# EAGLE design POW-REV2 (EAGLE 7.4.0)
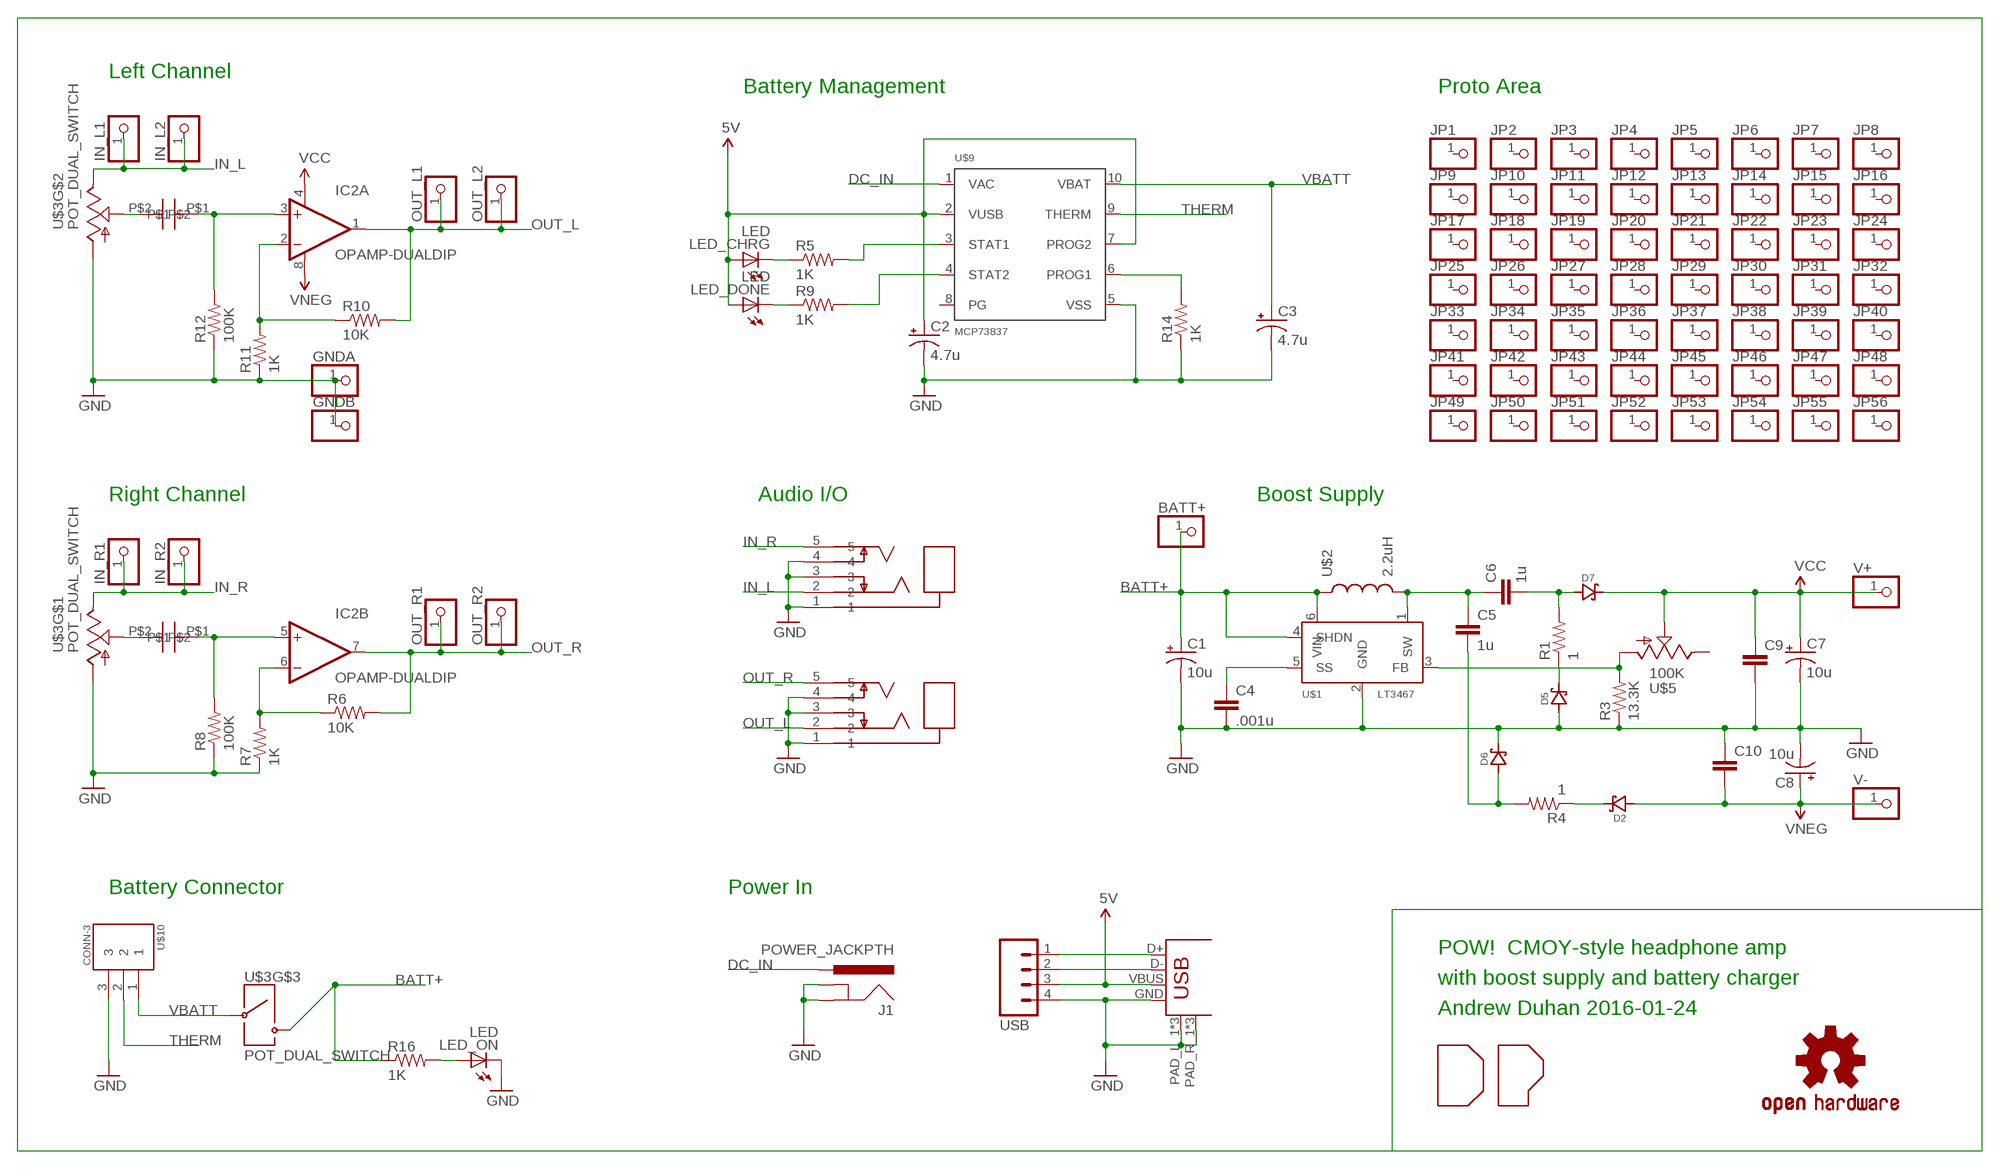
[diagram p0: schematic, sheet 1]

## Parts
BATT+  PINHD-1X1CB  [1X01-CLEANBIG]
C1  10u  CPOL-USE2,5-6E  [E2,5-6E]
C2  4.7u  CPOL-USE2,5-6E  [E2,5-6E]
C3  4.7u  CPOL-USE2,5-6E  [E2,5-6E]
C4  .001u  CAPPTH  [CAP-PTH-SMALL]
C5  1u  CAPPTH  [CAP-PTH-SMALL]
C6  1u  CAPPTH  [CAP-PTH-SMALL]
C7  10u  CPOL-USE2,5-6E  [E2,5-6E]
C8  10u  CPOL-USE2,5-6E  [E2,5-6E]
C9  CAPPTH  [CAP-PTH-SMALL]
C10  CAPPTH  [CAP-PTH-SMALL]
D2  SCHOTTKY  [SOD-123]
D5  SCHOTTKY  [SOD-123]
D6  SCHOTTKY  [SOD-123]
D7  SCHOTTKY  [SOD-123]
GNDA  PINHD-1X1CB  [1X01-CLEANBIG]
GNDB  PINHD-1X1CB  [1X01-CLEANBIG]
IC2  OPAMP-DUALDIP  [DIP08]
IN_JACK  JACK_STEREO_SWCUI-SJ1-351X  [AUDIO_JACK-CUI-SJ1-351X]
IN_L1  PINHD-1X1CB  [1X01-CLEANBIG]
IN_L2  PINHD-1X1CB  [1X01-CLEANBIG]
IN_R1  PINHD-1X1CB  [1X01-CLEANBIG]
IN_R2  PINHD-1X1CB  [1X01-CLEANBIG]
J1  POWER_JACKPTH  [POWER_JACK_PTH]
JP1  PINHD-1X1CB  [1X01-CLEANBIG]
JP2  PINHD-1X1CB  [1X01-CLEANBIG]
JP3  PINHD-1X1CB  [1X01-CLEANBIG]
JP4  PINHD-1X1CB  [1X01-CLEANBIG]
JP5  PINHD-1X1CB  [1X01-CLEANBIG]
JP6  PINHD-1X1CB  [1X01-CLEANBIG]
JP7  PINHD-1X1CB  [1X01-CLEANBIG]
JP8  PINHD-1X1CB  [1X01-CLEANBIG]
JP9  PINHD-1X1CB  [1X01-CLEANBIG]
JP10  PINHD-1X1CB  [1X01-CLEANBIG]
JP11  PINHD-1X1CB  [1X01-CLEANBIG]
JP12  PINHD-1X1CB  [1X01-CLEANBIG]
JP13  PINHD-1X1CB  [1X01-CLEANBIG]
JP14  PINHD-1X1CB  [1X01-CLEANBIG]
JP15  PINHD-1X1CB  [1X01-CLEANBIG]
JP16  PINHD-1X1CB  [1X01-CLEANBIG]
JP17  PINHD-1X1CB  [1X01-CLEANBIG]
JP18  PINHD-1X1CB  [1X01-CLEANBIG]
JP19  PINHD-1X1CB  [1X01-CLEANBIG]
JP20  PINHD-1X1CB  [1X01-CLEANBIG]
JP21  PINHD-1X1CB  [1X01-CLEANBIG]
JP22  PINHD-1X1CB  [1X01-CLEANBIG]
JP23  PINHD-1X1CB  [1X01-CLEANBIG]
JP24  PINHD-1X1CB  [1X01-CLEANBIG]
JP25  PINHD-1X1CB  [1X01-CLEANBIG]
JP26  PINHD-1X1CB  [1X01-CLEANBIG]
JP27  PINHD-1X1CB  [1X01-CLEANBIG]
JP28  PINHD-1X1CB  [1X01-CLEANBIG]
JP29  PINHD-1X1CB  [1X01-CLEANBIG]
JP30  PINHD-1X1CB  [1X01-CLEANBIG]
JP31  PINHD-1X1CB  [1X01-CLEANBIG]
JP32  PINHD-1X1CB  [1X01-CLEANBIG]
JP33  PINHD-1X1CB  [1X01-CLEANBIG]
JP34  PINHD-1X1CB  [1X01-CLEANBIG]
JP35  PINHD-1X1CB  [1X01-CLEANBIG]
JP36  PINHD-1X1CB  [1X01-CLEANBIG]
JP37  PINHD-1X1CB  [1X01-CLEANBIG]
JP38  PINHD-1X1CB  [1X01-CLEANBIG]
JP39  PINHD-1X1CB  [1X01-CLEANBIG]
JP40  PINHD-1X1CB  [1X01-CLEANBIG]
JP41  PINHD-1X1CB  [1X01-CLEANBIG]
JP42  PINHD-1X1CB  [1X01-CLEANBIG]
JP43  PINHD-1X1CB  [1X01-CLEANBIG]
JP44  PINHD-1X1CB  [1X01-CLEANBIG]
JP45  PINHD-1X1CB  [1X01-CLEANBIG]
JP46  PINHD-1X1CB  [1X01-CLEANBIG]
JP47  PINHD-1X1CB  [1X01-CLEANBIG]
JP48  PINHD-1X1CB  [1X01-CLEANBIG]
JP49  PINHD-1X1CB  [1X01-CLEANBIG]
JP50  PINHD-1X1CB  [1X01-CLEANBIG]
JP51  PINHD-1X1CB  [1X01-CLEANBIG]
JP52  PINHD-1X1CB  [1X01-CLEANBIG]
JP53  PINHD-1X1CB  [1X01-CLEANBIG]
JP54  PINHD-1X1CB  [1X01-CLEANBIG]
JP55  PINHD-1X1CB  [1X01-CLEANBIG]
JP56  PINHD-1X1CB  [1X01-CLEANBIG]
LED_CHRG  LED  [SSF-LXH25780ID]
LED_DONE  LED  [SSF-LXH25780ID]
LED_ON  LED  [SSF-LXH25780ID]
LOGO1  OSHW-LOGOS  [OSHW-LOGO-S]
OUT_JACK  JACK_STEREO_SWCUI-SJ1-351X  [AUDIO_JACK-CUI-SJ1-351X]
OUT_L1  PINHD-1X1CB  [1X01-CLEANBIG]
OUT_L2  PINHD-1X1CB  [1X01-CLEANBIG]
OUT_R1  PINHD-1X1CB  [1X01-CLEANBIG]
OUT_R2  PINHD-1X1CB  [1X01-CLEANBIG]
R1  1  RESISTORAXIAL-0.3  [AXIAL-0.3]
R3  13.3K  RESISTORAXIAL-0.3  [AXIAL-0.3]
R4  1  RESISTORAXIAL-0.3  [AXIAL-0.3]
R5  1K  RESISTORAXIAL-0.3  [AXIAL-0.3]
R6  10K  RESISTORAXIAL-0.3  [AXIAL-0.3]
R7  1K  RESISTORAXIAL-0.3  [AXIAL-0.3]
R8  100K  RESISTORAXIAL-0.3  [AXIAL-0.3]
R9  1K  RESISTORAXIAL-0.3  [AXIAL-0.3]
R10  10K  RESISTORAXIAL-0.3  [AXIAL-0.3]
R11  1K  RESISTORAXIAL-0.3  [AXIAL-0.3]
R12  100K  RESISTORAXIAL-0.3  [AXIAL-0.3]
R14  1K  RESISTORAXIAL-0.3  [AXIAL-0.3]
R16  1K  RESISTORAXIAL-0.3  [AXIAL-0.3]
U$1  LT3467  [SOT23-6]
U$2  2.2uH  INDUCTOR-SMD-MED6  [INDUCTOR_4.5X5]
U$3  POT_DUAL_SWITCH  [POT_ALPS_RK097]
U$4  USB  [USB-MICRO-MOLEX-SMD]
U$5  100K  TRIMPOTMURATA  [TRIM-MURATA-PV36W]
U$6  DP_LOGO  [DP_LOGO]
U$7  0.1u  CAPMKP_RADIAL_7.2X6  [CAP-MKP_RADIAL]
U$8  0.1u  CAPMKP_RADIAL_7.2X6  [CAP-MKP_RADIAL]
U$9  MCP73837  [MSOP-10]
U$10  CONN-3  [CONN-0530480310]
USB  M04PTH  [1X04]
V+  PINHD-1X1CB  [1X01-CLEANBIG]
V-  PINHD-1X1CB  [1X01-CLEANBIG]

## Nets
5V: C2.+ LED_CHRG.ANODE(A) LED_DONE.ANODE(A) U$4.VBUS U$9.2(VUSB) U$9.7(PROG2) USB.3
BATT+: BATT+.1 C1.+ R16.P$1 U$1.4(SHDN) U$1.6(VIN) U$2.P$1 U$3.SW1
DC_IN: J1.PWR U$9.1(VAC)
GND: C1.- C2.- C3.- C4.2 C7.- C8.- C9.2 C10.1 D5.ANODE D6.CATHODE GNDA.1 GNDB.1 IN_JACK.1 IN_JACK.3 IN_JACK.4 J1.GND J1.GNDBREAK LED_ON.CATHODE(C) OUT_JACK.1 OUT_JACK.3 OUT_JACK.4 R3.P$1 R7.P$1 R8.P$1 R11.P$1 R12.P$1 R14.P$1 U$1.2(GND) U$3.POT1_A(A) U$3.POT2_A(A) U$4.GND U$4.PAD_L_1 U$4.PAD_L_2 U$4.PAD_L_3 U$4.PAD_R_1 U$4.PAD_R_2 U$4.PAD_R_3 U$9.5(VSS) U$10.3 USB.4
IN_L: IN_JACK.2 IN_L1.1 IN_L2.1 U$3.POT2_B(B)
IN_R: IN_JACK.5 IN_R1.1 IN_R2.1 U$3.POT1_B(B)
N$1: LED_ON.ANODE(A) R16.P$2
N$2: LED_CHRG.CATHODE(C) R5.P$1
N$3: C4.1 U$1.5(SS)
N$4: C5.1 C6.1 U$1.1(SW) U$2.P$2
N$5: C5.2 D6.ANODE R4.P$2
N$6: R3.P$2 U$1.3(FB) U$5.A
N$7: C6.2 D7.ANODE R1.P$2
N$8: IC2.6(B:-IN) R6.P$1 R7.P$2
N$9: D2.CATHODE R4.P$1
N$10: IC2.5(B:+IN) R8.P$2 U$7.P$1
N$11: D5.CATHODE R1.P$1
N$12: IC2.3(A:+IN) R12.P$2 U$8.P$1
N$13: IC2.2(A:-IN) R10.P$1 R11.P$2
N$14: LED_DONE.CATHODE(C) R9.P$1
N$15: U$3.POT1_W(W) U$7.P$2
N$16: U$3.POT2_W(W) U$8.P$2
N$18: R5.P$2 U$9.3(STAT1)
N$19: R9.P$2 U$9.4(STAT2)
N$23: R14.P$2 U$9.6(PROG1)
OUT_L: IC2.1(A:OUT) OUT_JACK.2 OUT_L1.1 OUT_L2.1 R10.P$2
OUT_R: IC2.7(B:OUT) OUT_JACK.5 OUT_R1.1 OUT_R2.1 R6.P$2
THERM: U$9.9(THERM) U$10.2
USB_D+: U$4.D+ USB.1
USB_D-: U$4.D- USB.2
VBATT: C3.+ U$3.SW2 U$9.10(VBAT) U$10.1
VCC: C7.+ C9.1 D7.CATHODE IC2.4(A:V-) U$5.W V+.1
VNEG: C8.+ C10.2 D2.ANODE IC2.8(A:V+) V-.1
Unconnected: JP1.1 JP2.1 JP3.1 JP4.1 JP5.1 JP6.1 JP7.1 JP8.1 JP9.1 JP10.1 JP11.1 JP12.1 JP13.1 JP14.1 JP15.1 JP16.1 JP17.1 JP18.1 JP19.1 JP20.1 JP21.1 JP22.1 JP23.1 JP24.1 JP25.1 JP26.1 JP27.1 JP28.1 JP29.1 JP30.1 JP31.1 JP32.1 JP33.1 JP34.1 JP35.1 JP36.1 JP37.1 JP38.1 JP39.1 JP40.1 JP41.1 JP42.1 JP43.1 JP44.1 JP45.1 JP46.1 JP47.1 JP48.1 JP49.1 JP50.1 JP51.1 JP52.1 JP53.1 JP54.1 JP55.1 JP56.1 U$5.B U$9.8(PG)

## Notes on the sheet
- Left Channel
- Battery Management | Proto Area
- Right Channel | Audio I/O | Boost Supply
- Battery Connector | Power In
- POW!  CMOY-style headphone amp
- with boost supply and battery charger
- Andrew Duhan 2016-01-24

## Library data of the parts
BATT+ GNDA GNDB IN_L1 IN_L2 IN_R1 IN_R2 JP1-JP56 OUT_L1 OUT_L2 OUT_R1 OUT_R2 V+ V- = adafruit:PINHD-1X1: Pin header 1x1 for 0.1" spacing With round pins
C1-C3 C7 C8 = adafruit:CPOL-US: POLARIZED CAPACITOR, American symbol
C4-C6 C9 C10 = SparkFun-Capacitors:CAP: Capacitor Standard 0603 ceramic capacitor, and 0.1" leaded capacitor.
D2 D5-D7 = myparts:SCHOTTKY
IC2 = SparkFun-AnalogIC:OPAMP-DUAL: Generic op-amp footprint
IN_JACK OUT_JACK = myparts:JACK_STEREO_SW
J1 = SparkFun-Connectors:POWER_JACK: Power Jack This is the standard 5.5mm barrel jack for power. The PTH is the most common, proven, reliable, footprint. The Slot footprint only works if the mill layer is transmitted to the PCB fab house so be warned. Spark Fun Electronics SKU : PRT-00119 SMT: CONN-08106 Mating wall wart : TOL-00298 (and others)
LED_CHRG LED_DONE LED_ON = myparts:LED
LOGO1 = SparkFun-Aesthetics:OSHW-LOGO: Open Source Hardware Logo This logo indicates the piece of hardware it is found on incorporates a OSHW license and/or adheres to the definition of open source hardware found here: http://freedomdefined.org/OSHW
R1 R3-R12 R14 R16 = SparkFun-Resistors:RESISTOR: Resistor Basic schematic elements and footprints for 0603, 1206, and PTH resistors.
U$1 = myparts:LT3467
U$2 = myparts:INDUCTOR-SMD-MED
U$3 = myparts:POT_DUAL_SWITCH
U$4 = myparts:USB
U$5 = myparts:TRIMPOT
U$6 = myparts:DP_LOGO: Duhan Power! logo
U$7 U$8 = myparts:CAP
U$9 = myparts:MCP73837
U$10 = myparts:CONN-3
USB = SparkFun-Connectors:M04: Header 4 Standard 4-pin 0.1" header. Use with straight break away headers (SKU : PRT-00116), right angle break away headers (PRT-00553), swiss pins (PRT-00743), machine pins (PRT-00117), and female headers (PRT-00115). Molex polarized connector foot print use with SKU : PRT-08231 with associated crimp pins and housings. 1MM SMD Version SKU: PRT-10208

## Board
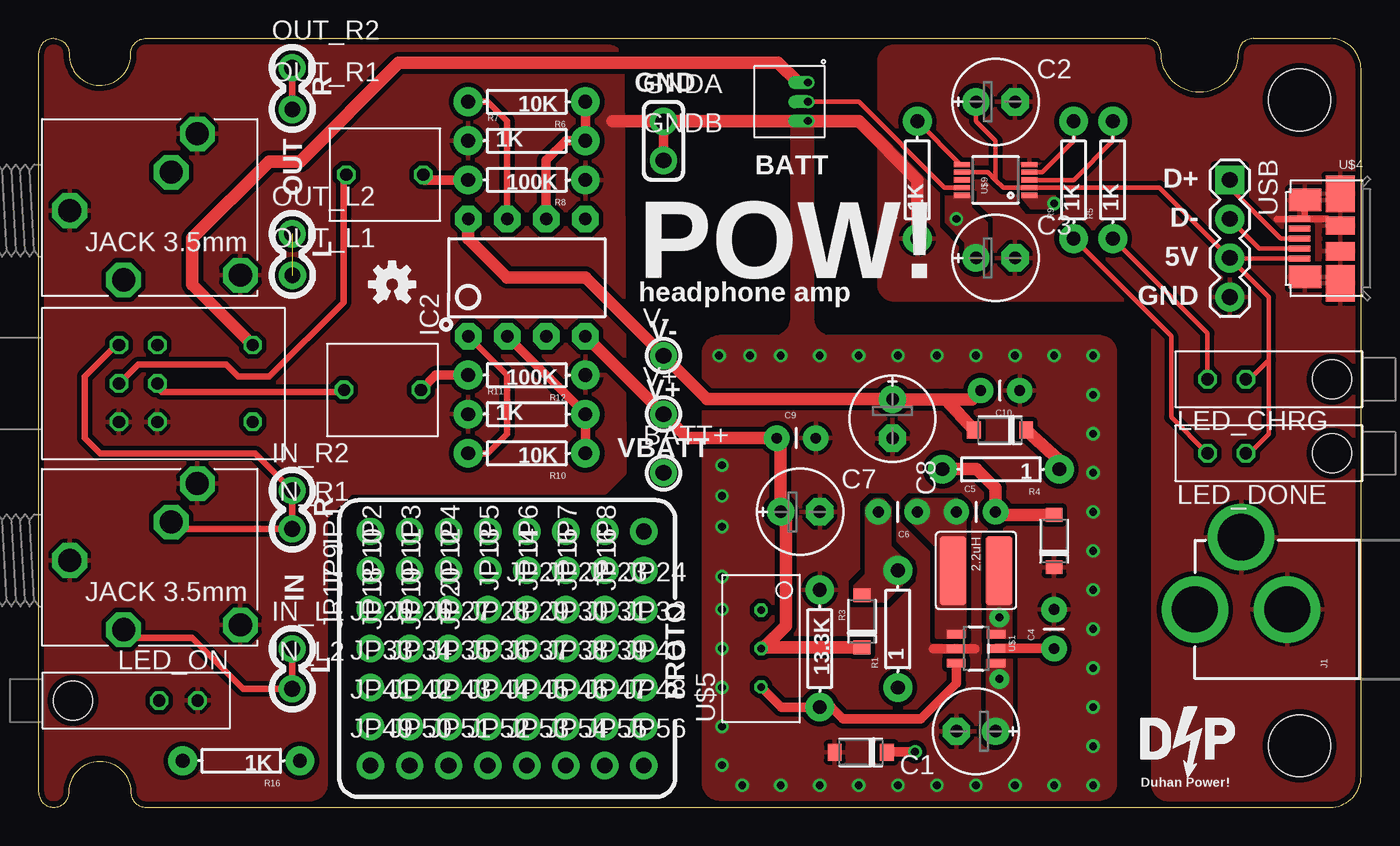
[diagram p1: board, top side]
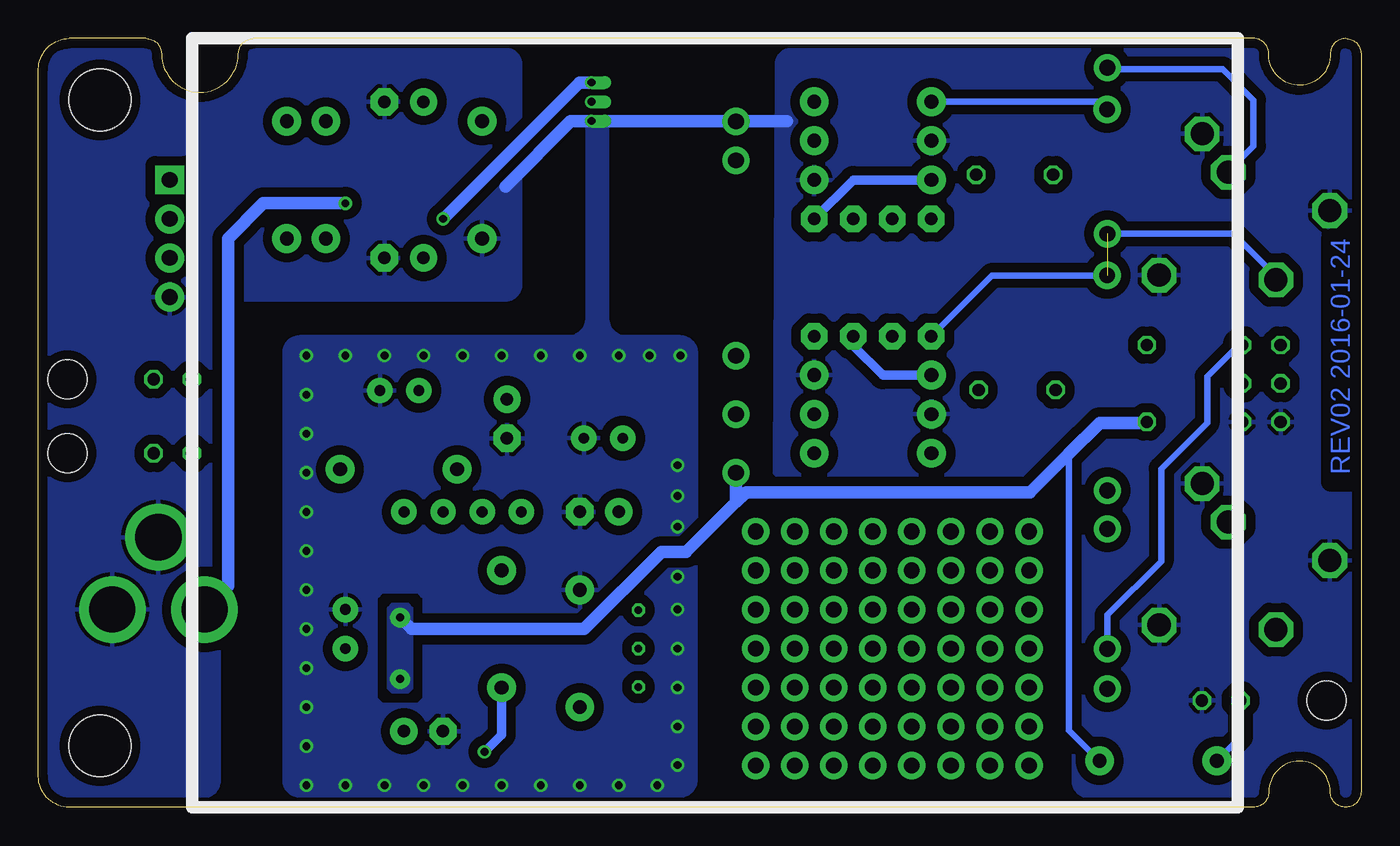
[diagram p2: board, bottom side, seen from below]

Size 86 x 50 mm. Coordinates in mm from the lower left corner, seen from the top.
Outline: 84,0 arc90 86,2 86,48 arc90 84,50 79,50 arc90 78,49 arc-180 73,49 arc90 72,50 6.9,50 arc90 6,48.9 arc-180 2,49 arc90 1,50 arc90 0,49 0,1 arc90 1,0 arc90 2,1 arc-180 6,1 arc90 7,0 84,0
Copper layers (1*16): Top 0.0356mm / dielectric 1.5011mm / Bottom 0.0356mm
Design rules "LaenPCBOrder *": minimum track width 6mil, minimum drill 13mil, track to track 6mil, track to pad 6mil, pad to pad 6mil, via to via 6mil, smd to smd 6mil, copper to edge 15mil, drill to drill 6mil, minimum pad ring 7mil, minimum via ring 7mil, stop-mask expansion 4mil, vias tented up to drill 24mil, thermal gap 10mil
Holes 4 mm at 82,4 82,46

### Footprints (pad centres in the part's own frame; a part is rotated, then mirrored left to right if it is on the bottom)
1X01-CLEANBIG = drill 1.016 pad 1.778: 1 0,0
E2,5-6E = drill 0.813 pad 1.778: + -1.27,0 | drill 0.813 pad 1.778 octagon: - 1.27,0
CAP-PTH-SMALL = drill 0.7 pad 1.651: 1 0,0; 2 2.54,0
SOD-123 = smd 0.9 x 1.1: ANODE -1.7,0; CATHODE 1.7,0
DIP08 = drill 0.813 pad 1.727 octagon: 1 -3.81,-3.81; 2 -1.27,-3.81; 3 1.27,-3.81; 4 3.81,-3.81; 5 3.81,3.81; 6 1.27,3.81; 7 -1.27,3.81; 8 -3.81,3.81
AUDIO_JACK-CUI-SJ1-351X = drill 1.5 octagon: 1 0,0; 2 3.5,-4.5; 3 8.3,5; 4 11.1,-4.2; 5 6.6,2.5
POWER_JACK_PTH = drill 2.997 pad 4.318: GND 0,7.7; GNDBREAK 4.7,10.7; PWR 0,13.7
SSF-LXH25780ID = drill 0.8 octagon: ANODE -1.5,0; CATHODE -4,0 | hole 2.54: 4.1,0
AXIAL-0.3 = drill 0.9 pad 1.88: P$1 -3.81,0; P$2 3.81,0
SOT23-6 = smd 0.55 x 1.2: 1 -0.95,-1.3; 2 0,-1.3; 3 0.95,-1.3; 4 0.95,1.3; 5 0,1.3; 6 -0.95,1.3
INDUCTOR_4.5X5 = smd 4.5 x 1.75: P$1 0,1.5; P$2 0,-1.5
POT_ALPS_RK097 = drill 0.8 octagon: POT1_A 2.9,2.5; POT1_B 2.9,-2.5; POT1_W 2.9,0; POT2_A 0.4,2.5; POT2_B 0.4,-2.5; POT2_W 0.4,0; SW1 -5.8,2.5; SW2 -5.8,-2.5
USB-MICRO-MOLEX-SMD = smd 0.4 x 1.38: D+ 0,4.11; D- -0.65,4.11; GND 1.3,4.11; ID 0.65,4.11; VBUS -1.3,4.11 | smd 1.475 x 2.1: PAD_L_1 -2.5,3.75; PAD_R_1 2.5,3.75 | smd 2.375 x 1.9: PAD_L_2 -2.913,1.45; PAD_R_2 2.913,1.45 | smd 1.175 x 1.9: PAD_L_3 -0.838,1.45; PAD_R_3 0.838,1.45
TRIM-MURATA-PV36W = drill 0.5 octagon: A -2.5,0; B 2.5,0; W 0,0
CAP-MKP_RADIAL = drill 0.8 octagon: P$1 -2.5,0; P$2 2.5,0
MSOP-10 = smd 0.34 x 1.04: 1 -1,-2.2; 2 -0.5,-2.2; 3 0,-2.2; 4 0.5,-2.2; 5 1,-2.2; 6 1,2.2; 7 0.5,2.2; 8 0,2.2; 9 -0.5,2.2; 10 -1,2.2
CONN-0530480310 = drill 0.5 pad 0.813 offset: 1 1.25,0; 2 0,0; 3 -1.25,0
1X04 = drill 1.016 pad 1.88 square: 1 0,0 | drill 1.016 pad 1.88: 2 2.54,0; 3 5.08,0; 4 7.62,0

### Placement (x,y rotation side)
BATT+  40.64,21.75 0 top
C1  60.96,4.94 180 top
C2  62.23,45.88 0 top
C3  62.23,35.72 0 top
C4  66.04,10.32 90 top
C5  59.69,19.21 0 top
C6  57.15,19.21 180 top
C7  49.53,19.21 0 top
C8  55.53,25.26 270 top
C9  48,24 0 top
C10  63.8,27.1 180 top
D2  62.52,24.53 0 top
D5  53.47,3.57 0 top
D6  66.04,17.31 270 top
D7  53.54,12.09 270 top
GNDA  40.64,44.61 0 top
GNDB  40.64,42.07 0 top
IC2  31.75,34.45 0 top
IN_JACK  2.03,16.05 0 top
IN_L1  16.5,10.3 0 top
IN_L2  16.5,7.7 0 top
IN_R1  16.5,18.1 0 top
IN_R2  16.5,20.6 0 top
J1  88.9,12.86 90 top
JP1  21.59,17.94 90 top
JP2  24.13,17.94 90 top
JP3  26.67,17.94 90 top
JP4  29.21,17.94 90 top
JP5  31.75,17.94 90 top
JP6  34.29,17.94 90 top
JP7  36.83,17.94 90 top
JP8  39.37,17.94 90 top
JP9  21.59,15.4 90 top
JP10  24.13,15.4 90 top
JP11  26.67,15.4 90 top
JP12  29.21,15.4 90 top
JP13  31.75,15.4 90 top
JP14  34.29,15.4 90 top
JP15  36.83,15.4 90 top
JP16  39.37,15.4 90 top
JP17  21.59,12.86 90 top
JP18  24.13,12.86 90 top
JP19  26.67,12.86 90 top
JP20  29.21,12.86 90 top
JP21  31.75,12.86 0 top
JP22  34.29,12.86 0 top
JP23  36.83,12.86 0 top
JP24  39.37,12.86 0 top
JP25  21.59,10.32 0 top
JP26  24.13,10.32 0 top
JP27  26.67,10.32 0 top
JP28  29.21,10.32 0 top
JP29  31.75,10.32 0 top
JP30  34.29,10.32 0 top
JP31  36.83,10.32 0 top
JP32  39.37,10.32 0 top
JP33  21.59,7.78 0 top
JP34  24.13,7.78 0 top
JP35  26.67,7.78 0 top
JP36  29.21,7.78 0 top
JP37  31.75,7.78 0 top
JP38  34.29,7.78 0 top
JP39  36.83,7.78 0 top
JP40  39.37,7.78 0 top
JP41  21.59,5.24 0 top
JP42  24.13,5.24 0 top
JP43  26.67,5.24 0 top
JP44  29.21,5.24 0 top
JP45  31.75,5.24 0 top
JP46  34.29,5.24 0 top
JP47  36.83,5.24 0 top
JP48  39.37,5.24 0 top
JP49  21.59,2.7 0 top
JP50  24.13,2.7 0 top
JP51  26.67,2.7 0 top
JP52  29.21,2.7 0 top
JP53  31.75,2.7 0 top
JP54  34.29,2.7 0 top
JP55  36.83,2.7 0 top
JP56  39.37,2.7 0 top
LED_CHRG  80.01,27.83 0 top
LED_DONE  80.01,23.02 0 top
LED_ON  6.35,6.94 180 top
LOGO1  23,34 0 top
OUT_JACK  2.03,38.8 0 top
OUT_L1  16.51,34.59 0 top
OUT_L2  16.5,37.3 0 top
OUT_R1  16.51,45.38 0 top
OUT_R2  16.5,48.1 0 top
R1  55.88,11.59 90 top
R3  50.8,10.32 270 top
R4  62.58,21.98 180 top
R5  69.85,40.8 90 top
R6  31.75,45.88 180 top
R7  31.75,43.34 0 top
R8  31.75,40.8 180 top
R9  67.31,40.8 90 top
R10  31.75,23.02 180 top
R11  31.75,25.56 0 top
R12  31.75,28.1 180 top
R14  57.15,40.8 90 top
R16  13.19,3.02 180 top
U$1  60.96,10.32 270 top
U$2  60.96,15.4 270 top
U$3  8.13,27.56 180 top
U$4  86.11,36.99 90 top
U$5  46.99,10.32 90 top
U$6  74.56,4.46 0 top
U$7  22.53,41.14 180 top
U$8  22.37,27.14 180 top
U$9  62.23,40.8 90 top
U$10  50.04,45.88 90 top
USB  77.47,40.8 270 top
V+  40.64,25.56 0 top
V-  40.64,29.37 0 top

### Tracks (layer width: path | path; a pad name or v marks a point on that pad's centre or on a via)
5V
  Top 0.305: U$9.7 61.73,41.3 62.23,40.8 | 62.23,40.8 62.73,40.3 U$9.2 72.89,40.3 USB.3 | C2.+ 60.96,44.61 62.23,43.34 62.23,40.8 | U$4.VBUS 77.5,35.69 USB.3 | LED_CHRG.ANODE 78.74,27.83 80.01,29.1 | 80.01,29.1 80.01,33.18 USB.3 | LED_DONE.ANODE 78.74,23.02 80.01,24.29 80.01,29.1
BATT+  (via drill 0.51 pad 1.27)
  Top 0.61: 62.26,5.27 C1.+
  Bottom 0.406: 19,23 19,5 17,3 R16.P$1
  Bottom 0.813: v62.48,12.34 61.73,11.59 50.51,11.59 45.5,16.6 43.88,16.6 40.64,19.84 | 40.64,19.84 40,20.48 21.52,20.48 19,23 17,25 13.99,25 U$3.SW1 | BATT+.1 40.64,19.84
  other vias: 62.48,8.34
  pour Top (isolate 0.254, no thermals): 61.72,17.43 61.72,11.08 63.25,11.08 63.25,17.43
  pour Top (isolate 0.254, no thermals): 61.72,9.56 63.25,9.56 63.25,5.24 62.74,4.73 61.72,4.73
  pour Bottom (isolate 0.61, no thermals): 61.72,7.78 61.72,12.91 61.98,13.16 62.99,13.16 63.25,12.91 63.25,7.78 62.99,7.53 61.98,7.53
DC_IN  (via drill 0.51)
  Bottom 0.813: v66.04,39.28 71.37,39.28 73.66,36.99 73.66,14.4 J1.PWR
  pour Top (no thermals): 63.9,39.8 66.1,39.8 66.4,39.5 66.4,39.1 66.2,38.9 64.5,38.9 63.9,39.6
GND  (via drill 0.51)
  Top 0.305: 47.01,44.63 46.99,44.61
  Top 0.406: U$4.GND 83.79,38.29 83.82,38.26 82.3,38.26 | 82.3,38.26 80.52,38.26 | U$4.PAD_R_1 82.36,38.32 82.3,38.26
  Top 0.61: 60.9,10.3 58.2,10.3 | GNDB.1 GNDA.1
  Top 0.813: 37.34,44.61 GNDA.1 46.99,44.61 53.34,44.61 57.15,40.8 R14.P$1
  Bottom 0.813: 50.06,44.61 37.34,44.61 | 55.63,40.37 51.39,44.61 50.06,44.61 | 50.06,44.61 U$10.3
  other vias: 48.26,1.43 50.8,1.43 53.34,1.43 55.88,1.43 58.42,1.43 60.96,1.43 63.5,1.43 66.04,1.43 68.58,1.43 68.58,3.97 68.58,6.51 68.58,9.05 68.58,11.59 68.58,14.13 68.58,16.67 68.58,19.21 68.58,21.75 68.58,24.29 68.58,26.83 68.58,29.37 66.04,29.37 48.26,29.37 50.8,29.37 53.34,29.37 63.5,29.37 60.96,29.37 58.42,29.37 55.88,29.37 44.45,18.24 44.45,15 44.45,12.86 44.45,10.32 44.45,7.78 44.45,5.24 44.45,20.24 44.45,22.24 46.26,29.37 44.26,29.37 44.45,2.74 45.76,1.43
  pour Top (isolate 0.305): -0.02,49.49 36.98,49.48 arc-90 37.98,48.48 38.1,21.75 36.83,20.48 20.32,20.48 18.68,18.84 18.68,1.52 arc-88 17.68,0.52 -0.02,0.52
  pour Bottom (isolate 0.61, rank 6): -0.02,49.28 36.98,49.28 arc-90 37.98,48.28 38.1,21.75 36.83,20.48 20.32,20.48 18.68,18.84 18.68,1.72 arc-90 17.68,0.72 -0.02,0.72
  pour Top (isolate 0.305, rank 6): 43.29,1.56 43.29,29.56 arc-90 44.29,30.56 69,30.56 arc-90 70,29.56 70,1.56 arc-90 69,0.56 44.29,0.56 arc-90
  pour Bottom (isolate 0.61, rank 6): 43.29,1.76 43.25,29.52 arc-90 44.29,30.56 69,30.56 arc-90 70,29.56 70,1.76 arc-90 69,0.76 44.29,0.76 arc-90
  pour Top (isolate 0.305, rank 6): 55.67,49.48 84.76,49.48 arc-90 86.02,48.22 86.02,1.52 arc-90 85.02,0.52 73.49,0.52 arc-90 72.49,1.52 72.49,31.02 arc90 70.49,33.02 55.67,33.02 arc-90 54.67,34.02 54.67,48.48 arc-90
  pour Bottom (isolate 0.61, rank 6): 55.67,33.02 72.29,33.02 arc-90 74.29,31.02 74.29,1.72 arc90 75.29,0.72 85.02,0.72 arc90 86.02,1.72 86.02,48.04 arc90 84.78,49.28 55.67,49.28 arc90 54.67,48.28 54.67,34.02 arc90
  pour Top (isolate 0.254, no thermals): 49.02,44.86 50.29,44.86 50.29,31.81 arc90 51.56,30.54 52.07,30.54 52.07,29.37 46.99,29.37 46.99,30.54 47.75,30.54 arc90 49.02,31.81
  pour Bottom (isolate 0.254, no thermals): 49.02,44.86 50.29,44.86 50.29,31.81 arc90 51.56,30.54 52.07,30.54 52.07,29.37 46.99,29.37 46.99,30.54 47.75,30.54 arc90 49.02,31.81
IN_L
  Top 0.406: IN_JACK.2 6.08,11 10,11 13.3,7.7 IN_L2.1 IN_L1.1
  Bottom 0.406: U$3.POT2_B 7.94,30.06 10,28 10,25 13,22 13,16 16.5,12.5 IN_L1.1
IN_R
  Top 0.406: IN_JACK.5 9.08,18.1 IN_R1.1 IN_R2.1 14.1,23 4,23 3,24 3,28 5.06,30.06 U$3.POT1_B
N$1
  Bottom 0.406: LED_ON.ANODE 7.85,4.55 R16.P$2
N$2
  Top 0.305: LED_CHRG.CATHODE 76.01,30.83 R5.P$1
N$3
  Top 0.61: U$1.5 C4.1
N$4
  pour Top (isolate 0.254, no thermals): 58.42,16.99 58.42,11.08 60.2,11.08 60.2,19.46 59.69,19.97 56.9,19.97 56.48,19.56 56.48,18.96
N$5
  Top 0.813: D6.ANODE 62.43,19.01 C5.2 62.23,20.77 61,22 58.79,22 R4.P$2
N$6
  Top 0.61: U$1.3 59.69,9.34 59.69,8.05 57.39,5.75 52.32,5.75 51.56,6.51 R3.P$2 48.3,6.51 U$5.A
N$7
  pour Top (isolate 0.254, no thermals): 55.03,13.44 56.64,15.05 56.64,15.65 55.37,16.92 55.37,19.46 54.86,19.97 54.36,19.97 53.85,19.46 53.85,15.12 53.08,14.35 53.08,13.45 53.09,13.44
N$8
  Top 0.61: IC2.6 33.02,42.07 34.29,43.34 R7.P$2 R6.P$1
N$9
  Top 0.813: R4.P$1 66.39,22.56 D2.CATHODE
N$10
  Top 0.61: R8.P$2 25.09,40.8 U$7.P$1
  Bottom 0.61: IC2.5 33.02,40.8 R8.P$2
N$11  (via drill 0.51)
  Top 0.61: v57,3.6 55.2,3.6 D5.CATHODE
  Bottom 0.61: R1.P$1 55.88,4.72 v57,3.6
N$12
  Top 0.61: R12.P$2 25.83,28.1 U$8.P$1
  Bottom 0.61: R12.P$2 31.1,28.1 33,30 33,30.62 IC2.3
N$13
  Top 0.61: IC2.2 R11.P$2 R10.P$1
N$14
  Top 0.305: R9.P$1 73.66,30.64 73.66,25.37 LED_DONE.CATHODE
N$15
  Top 0.406: U$7.P$2 19.83,41 19.83,32.83 15,28 13,28 12.2,28.8 6.5,28.8 5.26,27.56 U$3.POT1_W
N$16
  Top 0.406: U$3.POT2_W 7.73,27.27 8,27 19.73,27 U$8.P$2
N$18
  Top 0.305: U$9.3 67.31,40.8 69.85,43.34 R5.P$2
N$19
  Top 0.305: U$9.4 65.27,41.3 67.31,43.34 R9.P$2
N$23
  Top 0.305: U$9.6 59.96,41.8 R14.P$2
OUT_L  (1 unrouted)
  Top 0.406: R10.P$2 29.21,23.02 30.48,24.29 30.48,28.1 IC2.1
  Bottom 0.406: OUT_JACK.2 5.53,34.53 8.3,37.3 OUT_L2.1 | OUT_L1.1 23.99,34.59 IC2.1
OUT_R
  Top 0.406: R6.P$2 29.21,45.88 30.48,44.61 IC2.7 | OUT_R2.1 OUT_R1.1
  Bottom 0.406: R6.P$2 17.01,45.88 OUT_R1.1 | OUT_JACK.5 8.63,41.37 7,43 7,46 9,48 16.4,48 OUT_R2.1
THERM
  Top 0.305: U$10.2 53.34,45.88 58.92,40.3 U$9.9
USB_D+
  Top 0.305: U$4.D+ 80.77,36.99 77.47,40.29 USB.1
USB_D-
  Top 0.305: U$4.D- 79.39,36.34 USB.2
VBATT  (via drill 0.51)
  Top 0.813: U$10.1 50.02,47.15 49.37,47.15 48.1,48.42 23.42,48.42 17,42 15,42 10,37 10,34 14,30 13.87,30 U$3.SW2
  Bottom 0.813: U$10.1 50.82,47.13 v59.69,38.26
  pour Top (isolate 0.254, no thermals): 58.93,39.78 60.71,39.78 60.71,39.02 61.72,38.01 61.72,35.47 61.21,34.96 60.71,34.96 60.2,35.47 60.2,36.74 58.93,38.01
VCC
  Top 0.813: IC2.4 V+.1 42.2,24 C9.1 48.26,23.74 C7.+ 48.6,18.87 48.6,11.8 47.12,10.32 U$5.W 47.06,10.39 D7.CATHODE
VNEG
  Top 0.813: IC2.8 27.94,36.99 30.48,34.45 35.56,34.45 V-.1 43.47,26.54 C8.+ 59.02,26.53 | 59.02,26.53 D2.ANODE | 59.02,26.53 60.69,26.53 C10.2

### Text on the board
Bottom: REV02 2016-01-24
tPlace: R | GND | OUT | D+ | BATT | D- | L | 5V | POW! | GND | headphone amp | V- | V+ | VBATT | R | IN | L | PROTO | Duhan Power!